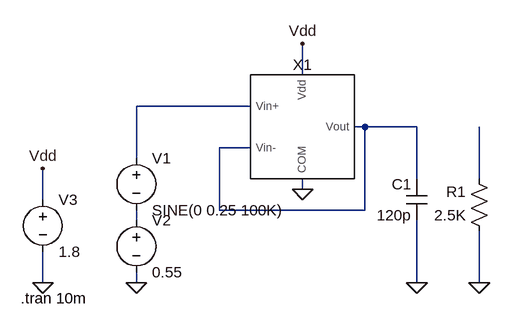
[diagram p0: schematic LargeSignal.asc]
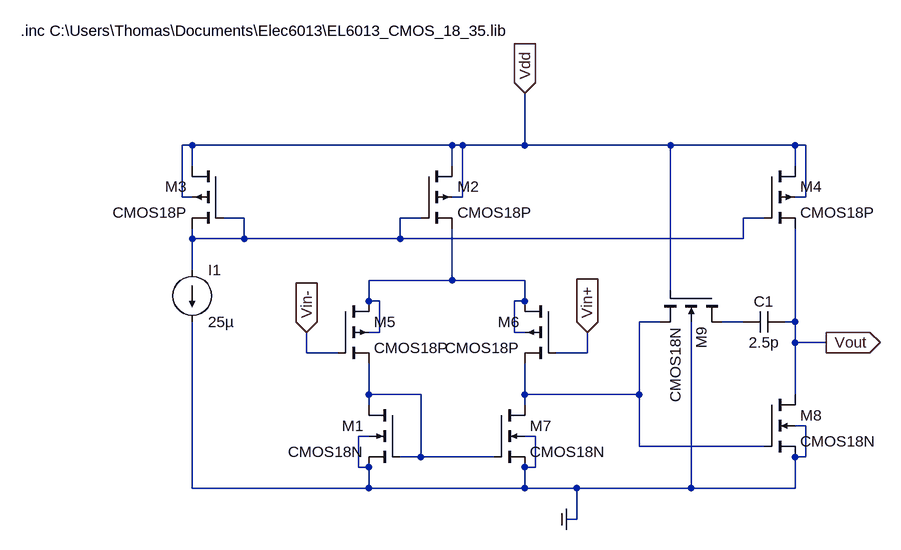
[diagram p1: sub-circuit coursework.asc]
LargeSignal.asc, the LTspice schematic file:
Version 4
SHEET 1 880 680
WIRE 368 -32 368 -80
WIRE 288 16 112 16
WIRE 464 48 448 48
WIRE 544 48 464 48
WIRE 288 80 240 80
WIRE 112 96 112 16
WIRE 544 128 544 48
WIRE 640 128 640 48
WIRE 368 144 368 128
WIRE -32 160 -32 112
WIRE 240 176 240 80
WIRE 464 176 464 48
WIRE 464 176 240 176
WIRE 112 192 112 176
WIRE -32 288 -32 240
WIRE 112 288 112 272
WIRE 544 288 544 192
WIRE 640 288 640 208
FLAG 112 288 0
FLAG 368 144 0
FLAG 368 -80 Vdd
FLAG -32 112 Vdd
FLAG -32 288 0
FLAG 544 288 0
FLAG 640 288 0
SYMBOL voltage 112 80 R0
WINDOW 123 0 0 Left 2
WINDOW 39 0 0 Left 2
SYMATTR InstName V1
SYMATTR Value SINE(0 0.25 100K)
SYMBOL voltage 112 176 R0
WINDOW 123 0 0 Left 2
WINDOW 39 0 0 Left 2
SYMATTR InstName V2
SYMATTR Value 0.55
SYMBOL res 656 224 R180
WINDOW 0 36 76 Left 2
WINDOW 3 36 40 Left 2
SYMATTR InstName R1
SYMATTR Value 2.5K
SYMBOL cap 560 192 R180
WINDOW 0 24 56 Left 2
WINDOW 3 24 8 Left 2
SYMATTR InstName C1
SYMATTR Value 120p
SYMBOL coursework 368 48 R0
SYMATTR InstName X1
SYMBOL voltage -32 144 R0
WINDOW 123 0 0 Left 2
WINDOW 39 0 0 Left 2
SYMATTR InstName V3
SYMATTR Value 1.8
TEXT -66 312 Left 2 !.tran 10m

coursework.asc, the sub-circuit schematic file:
Version 4
SHEET 1 880 680
WIRE -624 -96 -640 -96
WIRE -224 -96 -624 -96
WIRE -208 -96 -224 -96
WIRE -112 -96 -112 -176
WIRE -112 -96 -208 -96
WIRE 112 -96 -112 -96
WIRE 304 -96 112 -96
WIRE 320 -96 304 -96
WIRE -624 -64 -624 -96
WIRE -224 -64 -224 -96
WIRE 304 -64 304 -96
WIRE -640 -16 -640 -96
WIRE -624 -16 -640 -16
WIRE -208 -16 -208 -96
WIRE -208 -16 -224 -16
WIRE 320 -16 320 -96
WIRE 320 -16 304 -16
WIRE -544 16 -576 16
WIRE -272 16 -304 16
WIRE 256 16 224 16
WIRE -624 48 -624 32
WIRE -544 48 -544 16
WIRE -544 48 -624 48
WIRE -304 48 -304 16
WIRE -304 48 -544 48
WIRE 224 48 224 16
WIRE 224 48 -304 48
WIRE -624 96 -624 48
WIRE -224 112 -224 32
WIRE -224 112 -352 112
WIRE -112 112 -224 112
WIRE 112 128 112 -96
WIRE -352 144 -352 112
WIRE -336 144 -352 144
WIRE -112 144 -112 112
WIRE -112 144 -128 144
WIRE 96 176 64 176
WIRE 224 176 192 176
WIRE 304 176 304 32
WIRE 304 176 288 176
WIRE -336 192 -336 144
WIRE -336 192 -352 192
WIRE -128 192 -128 144
WIRE -112 192 -128 192
WIRE 304 208 304 176
WIRE 352 208 304 208
WIRE -448 224 -448 192
WIRE -400 224 -448 224
WIRE -16 224 -16 192
WIRE -16 224 -64 224
WIRE -352 288 -352 240
WIRE -272 288 -352 288
WIRE -112 288 -112 240
WIRE 64 288 64 176
WIRE 64 288 -112 288
WIRE 304 288 304 208
WIRE -352 304 -352 288
WIRE -112 304 -112 288
WIRE 320 336 304 336
WIRE -352 352 -368 352
WIRE -96 352 -112 352
WIRE 64 368 64 288
WIRE 256 368 64 368
WIRE -272 384 -272 288
WIRE -272 384 -304 384
WIRE -160 384 -272 384
WIRE 320 384 320 336
WIRE 320 384 304 384
WIRE -368 400 -368 352
WIRE -352 400 -368 400
WIRE -96 400 -96 352
WIRE -96 400 -112 400
WIRE -624 432 -624 176
WIRE -352 432 -352 400
WIRE -352 432 -624 432
WIRE -112 432 -112 400
WIRE -112 432 -352 432
WIRE -32 432 -112 432
WIRE 144 432 144 176
WIRE 144 432 -32 432
WIRE 304 432 304 384
WIRE 304 432 144 432
WIRE -32 480 -32 432
WIRE -32 480 -48 480
FLAG -112 -176 Vdd
IOPIN -112 -176 In
FLAG -16 192 Vin+
IOPIN -16 192 In
FLAG -448 192 Vin-
IOPIN -448 192 In
FLAG 352 208 Vout
IOPIN 352 208 Out
FLAG -48 480 COM
IOPIN -48 480 In
SYMBOL nmos4 -304 304 M0
SYMATTR InstName M1
SYMATTR Value CMOS18N
SYMATTR Value2 l=8.28 w=104.41
SYMBOL pmos4 -272 -64 R0
SYMATTR InstName M2
SYMATTR Value CMOS18P
SYMATTR Value2 l=1 w=40
SYMBOL pmos4 -576 -64 M0
SYMATTR InstName M3
SYMATTR Value CMOS18P
SYMATTR Value2 l=1 w=5
SYMBOL pmos4 256 -64 R0
SYMATTR InstName M4
SYMATTR Value CMOS18P
SYMATTR Value2 l=8.28 w=134.01
SYMBOL pmos4 -400 144 R0
SYMATTR InstName M5
SYMATTR Value CMOS18P
SYMATTR Value2 l=8.28 w=344.45
SYMBOL pmos4 -64 144 M0
SYMATTR InstName M6
SYMATTR Value CMOS18P
SYMATTR Value2 l=8.28 w=344.45
SYMBOL nmos4 -160 304 R0
SYMATTR InstName M7
SYMATTR Value CMOS18N
SYMATTR Value2 l=8.28 w=104.41
SYMBOL nmos4 256 288 R0
SYMATTR InstName M8
SYMATTR Value CMOS18N
SYMATTR Value2 l=8.28 w=84.46
SYMBOL nmos4 192 128 R90
SYMATTR InstName M9
SYMATTR Value CMOS18N
SYMATTR Value2 l=1 w=3.01
SYMBOL cap 288 160 R90
WINDOW 0 0 32 VBottom 2
WINDOW 3 32 32 VTop 2
SYMATTR InstName C1
SYMATTR Value 2.5p
SYMBOL current -624 96 R0
WINDOW 123 0 0 Left 2
WINDOW 39 0 0 Left 2
SYMATTR InstName I1
SYMATTR Value 25µ
TEXT -888 -272 Left 2 !.inc C:\\Users\\Thomas\\Documents\\Elec6013\\EL6013_CMOS_18_35.lib

The netlist it stands for:
* LargeSignal.asc
V1 N001 N004 SINE(0 0.25 100K)
V2 N004 0 0.55
R1 0 N003 2.5K
C1 0 N002 120p
XX1 0 Vdd N001 N002 N002 coursework
V3 Vdd 0 1.8

* block symbol definitions
.subckt coursework COM Vdd Vin+ Vin- Vout
M1 N005 N005 COM COM CMOS18N l=8.28 w=104.41
M2 Vdd N001 N002 Vdd CMOS18P l=1 w=40
M3 Vdd N001 N001 Vdd CMOS18P l=1 w=5
M4 Vdd N001 Vout Vdd CMOS18P l=8.28 w=134.01
M5 N002 Vin- N005 N002 CMOS18P l=8.28 w=344.45
M6 N002 Vin+ N003 N002 CMOS18P l=8.28 w=344.45
M7 N003 N005 COM COM CMOS18N l=8.28 w=104.41
M8 Vout N003 COM COM CMOS18N l=8.28 w=84.46
M9 N004 Vdd N003 COM CMOS18N l=1 w=3.01
C1 Vout N004 2.5p
I1 N001 COM 25µ
.inc C:\Users\Thomas\Documents\Elec6013\EL6013_CMOS_18_35.lib
.ends coursework

.model NMOS NMOS
.model PMOS PMOS
.lib standard.mos
.tran 10m
.backanno
.end